# Altium schematic sheet Display.SchDoc
size A4
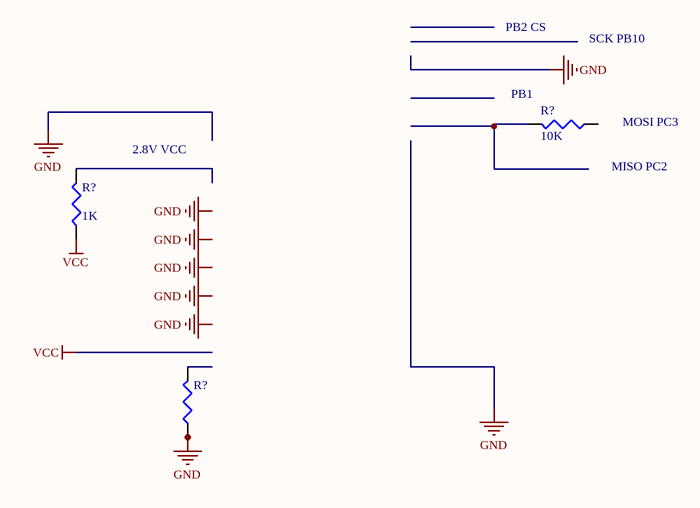
[diagram p0: Display.SchDoc]

## Parts
(Parts that share a designator on the sheet are numbered #1, #2 ... from top to bottom, then left to right.)
R?#1  value 10K  [J1-0603]  (hidden comment: Res3)
R?#2  value 1K  [J1-0603]  (hidden comment: Res3)
R?#3  Res3  [J1-0603]  (value not drawn)

## Nets
GND: R?#3.1
VCC: R?#2.1

Not connected (* = marked no-connect by the designer): R?#1 1 2; R?#2 2; R?#3 2

## Notes on the sheet
- PB2 CS
- SCK PB10
- (near R?#1) PB1
- 2.8V VCC
- (near R?#1) MISO PC2
- (near R?#1) MOSI PC3
- Labels drawn without touching a wire or pin: GND

## Library data of the parts
R?#1 R?#2 = Res3: Resistor; Published: 8-Jun-2000; LatestRevisionDate: 29-May-2009; LatestRevisionNote: IPC-7351 Footprint Added.; PackageReference: J1-0603; Publisher: Altium Limited; PackageDescription: Chip Resistor
R?#3 = Res3: Resistor; Value: 1K; Published: 8-Jun-2000; LatestRevisionDate: 29-May-2009; LatestRevisionNote: IPC-7351 Footprint Added.; PackageReference: J1-0603; Publisher: Altium Limited; PackageDescription: Chip Resistor